# Altium schematic sheet hcSwitch4x.SchDoc
size A
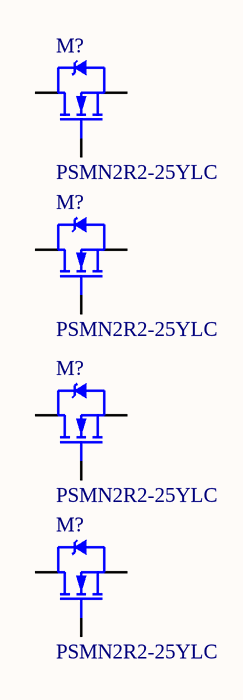
[diagram p0: hcSwitch4x.SchDoc]

## Parts
(Parts that share a designator on the sheet are numbered #1, #2 ... from top to bottom, then left to right.)
M?#1  PSMN2R2-25YLC  [POWER-SO8]
M?#2  PSMN2R2-25YLC  [POWER-SO8]
M?#3  PSMN2R2-25YLC  [POWER-SO8]
M?#4  PSMN2R2-25YLC  [POWER-SO8]

## Nets

Not connected (* = marked no-connect by the designer): M?#1 D(Drain) G(Gate) S(Source); M?#2 D(Drain) G(Gate) S(Source); M?#3 D(Drain) G(Gate) S(Source); M?#4 D(Drain) G(Gate) S(Source)

## Library data of the parts
M?#1-M?#4 = 3: N-Channel 25V 100A (Tc) 106W (Tc) Surface Mount LFPAK56, Power-SO8; id: 3; vdsmax: 0; numcircuits: 1; rdson: 2.5mOhm; vt: 4.5; vgsmax: 20; MfrPartNo: *; name: PSMN2R2-25YLC; type: N_Channel; current: 100A; package: LFPAK56; quantity: 0; link: https://www.digikey.com/product-detail/en/nexperia-usa-inc/PSMN2R2-25YLC115/1727-5299-1-ND/2674299